# EAGLE design 7v_reference (EAGLE 8.4.1)
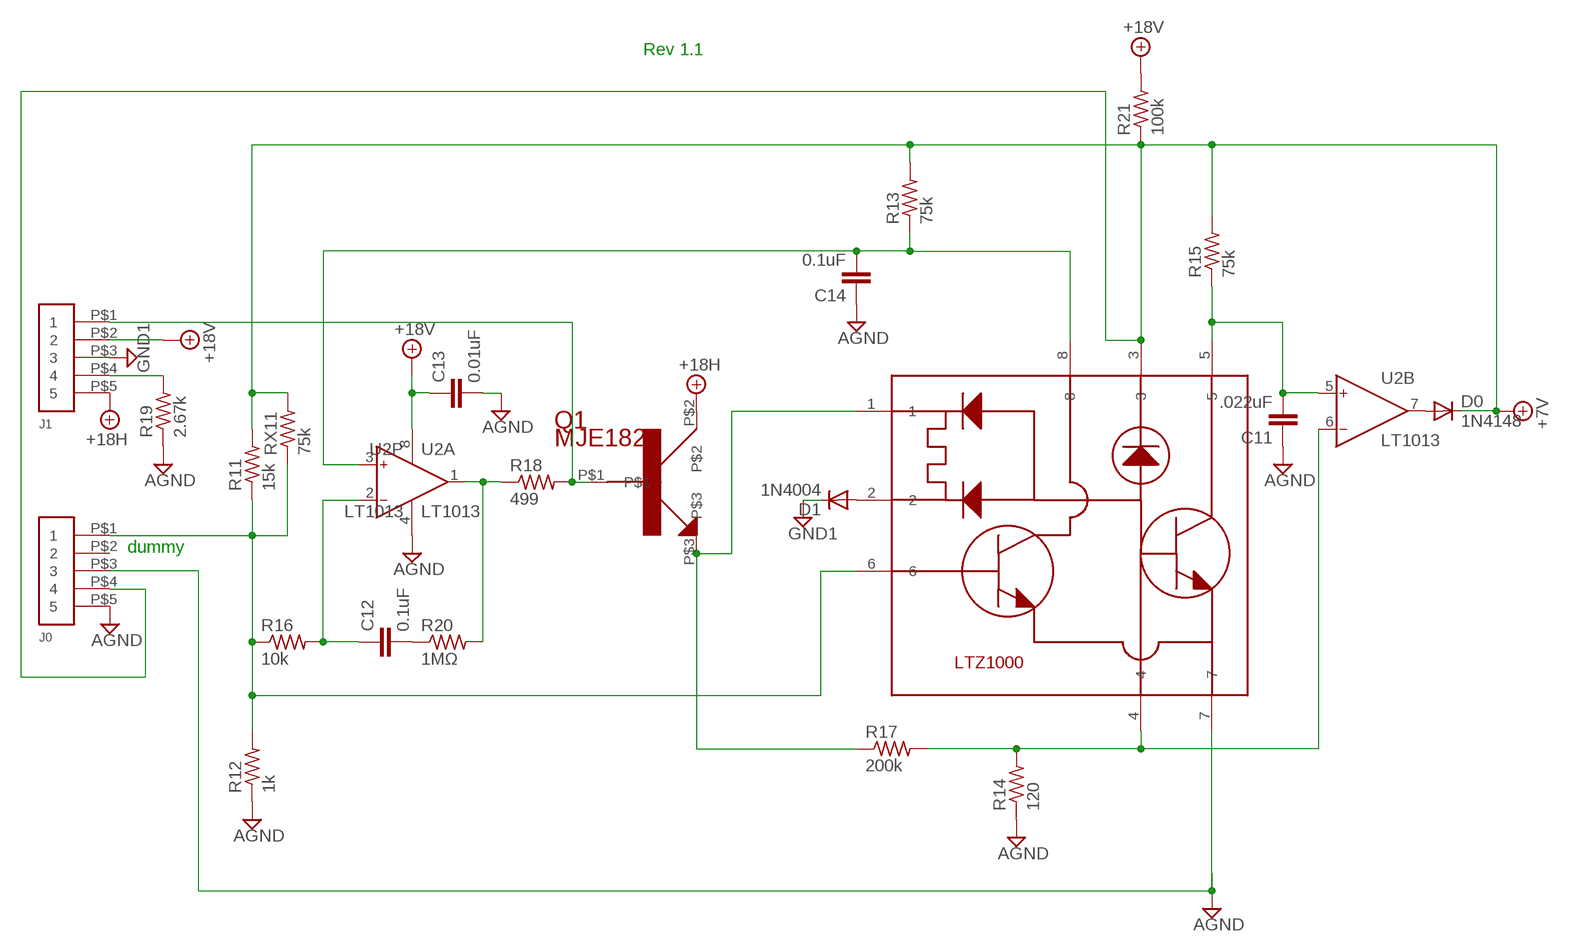
[diagram p0: schematic, sheet 1]

## Parts
C11  .022uF  C-EU102-043X133  [C102-043X133]
C12  0.1uF  C-EU102-043X133  [C102-043X133]
C13  0.01uF  C-EU102-043X133  [C102-043X133]
C14  0.1uF  C-EU102-043X133  [C102-043X133]
D0  1N4148  1N4446  [DO35-10]
D1  1N4004  [DO41-10]
J0  SOCKET1SOCKET1  [SOCKET1]
J1  SOCKET1SOCKET2  [SOCKET2]
Q1  MJE182  [SOT-32]
R11  15k  R-US_0411/3V  [0411V]
R12  1k  R-US_0411/3V  [0411V]
R13  75k  R-US_0207/10  [0207/10]
R14  120  R-US_0411/3V  [0411V]
R15  75k  R-US_0207/10  [0207/10]
R16  10k  R-US_0207/10  [0207/10]
R17  200k  R-US_0207/10  [0207/10]
R18  499  R-US_0207/10  [0207/10]
R19  2.67k  R-US_0207/10  [0207/10]
R20  1MΩ  R-US_0207/10  [0207/10]
R21  100k  R-US_0207/10  [0207/10]
RX11  75k  R-US_0207/10  [0207/10]
U2  LT1013  AD746N  [DIL08]
U$1  LTZ1000  [LTZ1000]

## Nets
+7V: D0.C J0.P$4 R11.2 R13.2 R15.2 R21.1 RX11.2 U$1.3
+18V: C13.1 J1.P$2 J1.P$5 Q1.P$2 R21.2 U2.8(P:V+) ; supply symbol labelled +18H
AGND: C11.1 C13.2 C14.1 J0.P$3 J0.P$5 R12.1 R14.1 R19.1 U2.4(P:V-) U$1.7
GND1: D1.C J1.P$3
N$1: C11.2 R15.1 U2.5(B:IN+) U$1.5
N$2: J1.P$1 Q1.P$1 R18.2
N$3: D1.A U$1.2
N$4: D0.A U2.7(B:OUT)
N$5: J0.P$1 R11.1 R12.2 R16.1 RX11.1 U$1.6
N$6: R14.2 R17.2 U2.6(B:IN-) U$1.4
N$7: C14.2 R13.1 U2.3(A:IN+) U$1.8
N$8: R18.1 R20.2 U2.1(A:OUT)
N$9: C12.1 R16.2 U2.2(A:IN-)
N$10: C12.2 R20.1
N$11: J1.P$4 R19.2
N$12: Q1.P$3 R17.1 U$1.1
Unconnected: J0.P$2

## Notes on the sheet
- Rev 1.1
- dummy

## Library data of the parts
C11-C14 = sb:C-EU: CAPACITOR, European symbol
D0 = sb:1N4446: DIODE high speed (Philips)
D1 = sb:1N4004: DIODE general purpose rectifier, 1 A
J0 J1 = sb:SOCKET1: Test Socket 1
Q1 = sb:MJE182
R11 R12 R14 = sb:R-US_: RESISTOR, American symbol
R13 R15-R21 RX11 = adafruit:R-US_: RESISTOR, American symbol
U2 = analog-devices:AD746: Dual Precision, 500 ns Settling, BiFET Op Amp Source: http://www.analog.com/static/imported-files/data_sheets/AD746.pdf; MF: ALTERA CORPORATION; MPN: AD746JNZ; OC_FARNELL: 1438363; OC_NEWARK: 59K4844
U$1 = sb:LTZ1000: LTZ1000 7V ref

## Board
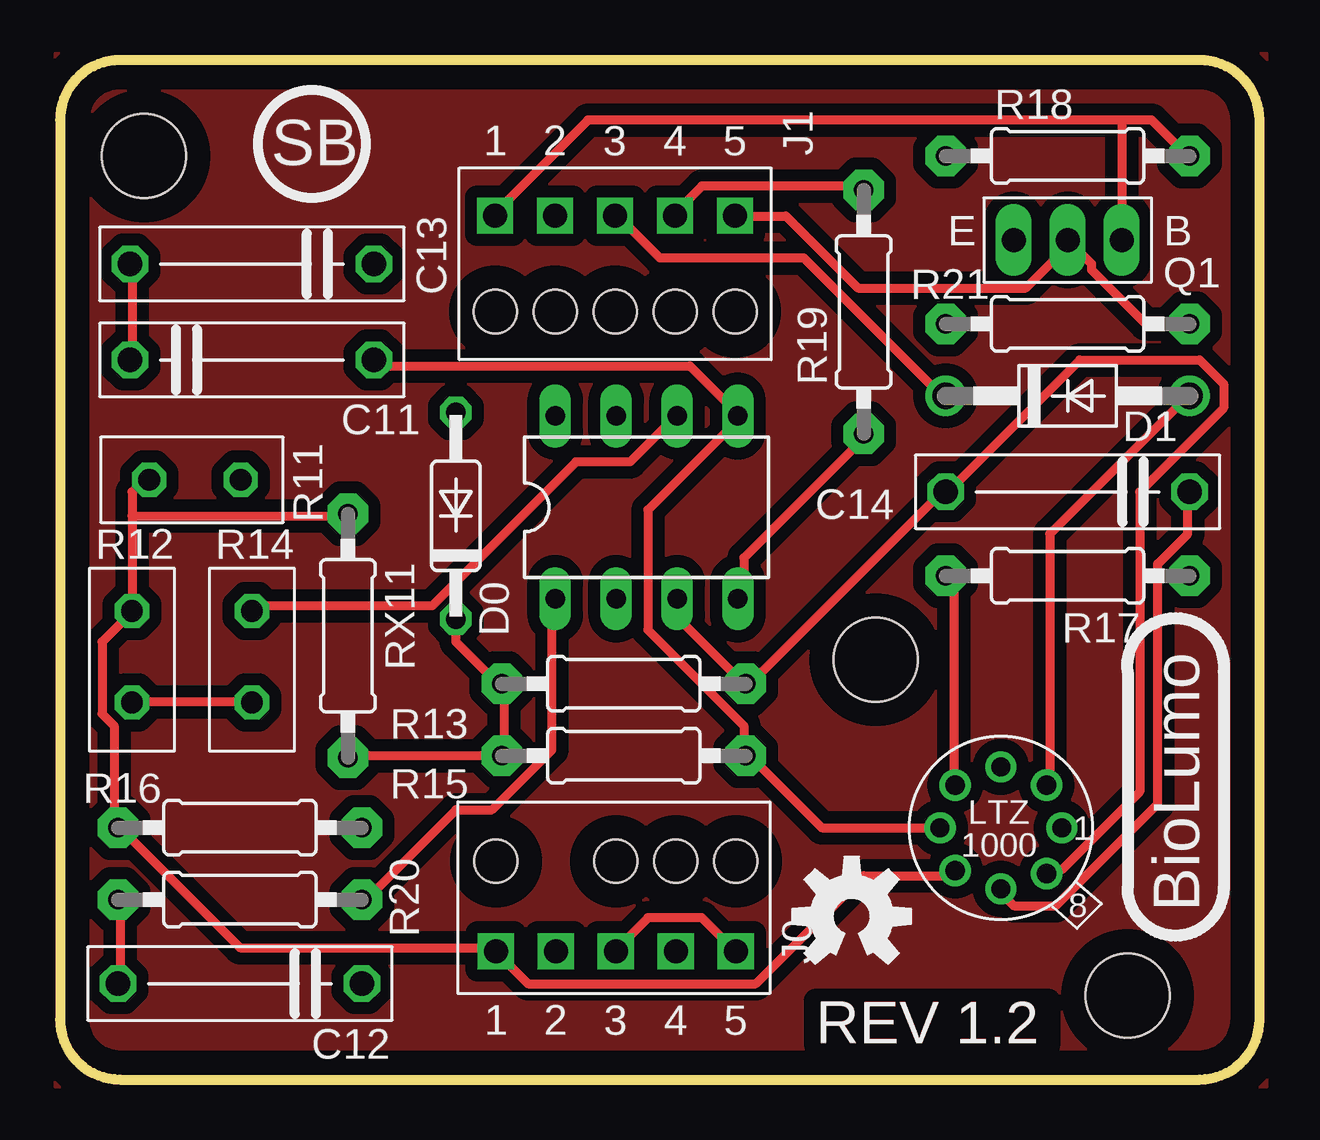
[diagram p1: board, top side]
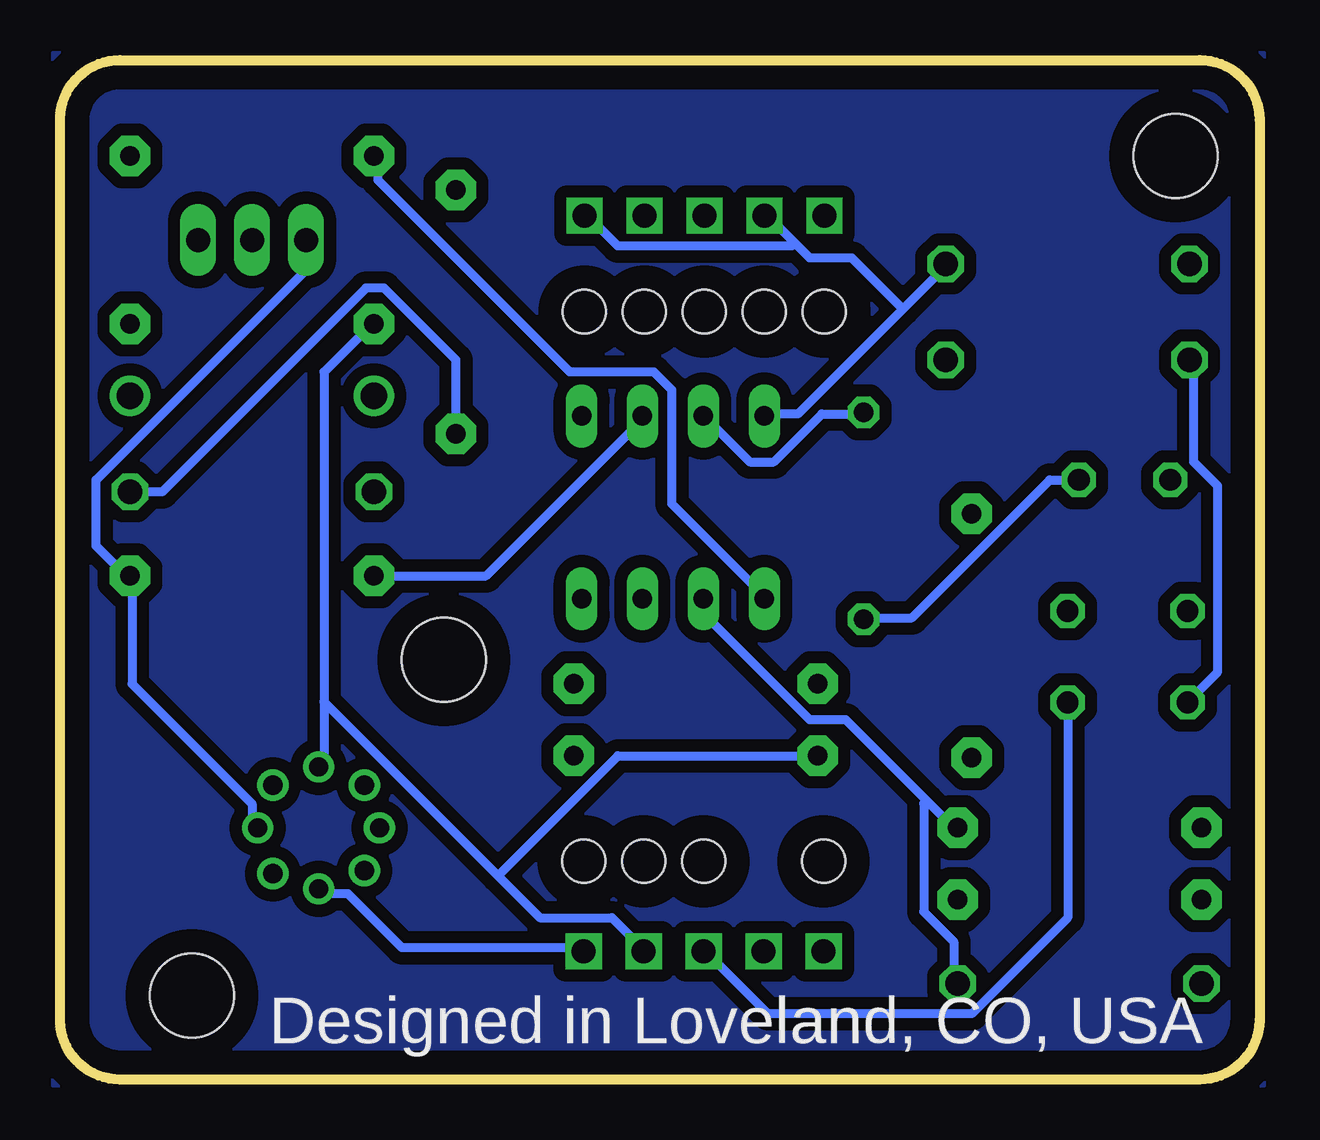
[diagram p2: board, bottom side, seen from below]

Size 50 x 42.5 mm. Coordinates in mm from the lower left corner, seen from the top.
Outline: 2.5,0 47.5,0 arc90 50,2.5 50,40 arc90 47.5,42.5 2.5,42.5 arc90 0,40 0,2.5 arc90 2.5,0
Copper layers (1*16): Top 0.035mm / dielectric 1.5mm / Bottom 0.035mm
Design rules "default *": minimum track width 15mil, minimum drill 24mil, track to track 20mil, track to pad 20mil, pad to pad 10mil, via to via 10mil, smd to smd 8mil, copper to edge 40mil, drill to drill 8mil, minimum pad ring 10mil, minimum via ring 8mil, stop-mask expansion 4mil, vias tented up to drill 0mil, thermal gap 10mil
Holes 3.5 mm at 3.5,38.5 44.5,3.5 34,17.5

### Footprints (pad centres in the part's own frame; a part is rotated, then mirrored left to right if it is on the bottom)
C102-043X133 = drill 1.016 octagon: 1 -5.08,0; 2 5.08,0
DO35-10 = drill 0.8 octagon: A 4.31,0; C -4.31,0
DO41-10 = drill 1.118: A 5.08,0; C -5.08,0
SOCKET1 = drill 1 square: P$1 -5,-2; P$2 -2.5,-2; P$3 0,-2; P$4 2.5,-2; P$5 5,-2 | hole 1.8: -5,1.75; 0,1.75; 2.5,1.75; 5,1.75
SOCKET2 = drill 1 square: P$1 -5,2; P$2 -2.5,2; P$3 0,2; P$4 2.5,2; P$5 5,2 | hole 1.8: -5,-2; -2.5,-2; 0,-2; 2.5,-2; 5,-2
SOT-32 = drill 1 long: P$1 2.25,0; P$2 0,0; P$3 -2.25,0
0411V = drill 0.914 octagon: 1 -1.778,0; 2 2.032,0
0207/10 = drill 0.813 pad 1.676 octagon: 1 -5.08,0; 2 5.08,0
DIL08 = drill 0.813 long: 1 -3.81,-3.81; 2 -1.27,-3.81; 3 1.27,-3.81; 4 3.81,-3.81; 5 3.81,3.81; 6 1.27,3.81; 7 -1.27,3.81; 8 -3.81,3.81
LTZ1000 = drill 0.8: 1 -2.54,0; 2 -1.905,-1.778; 3 0,-2.54; 4 1.905,-1.778; 5 2.54,0; 6 1.905,1.778; 7 0,2.54; 8 -1.905,1.905

### Placement (x,y rotation side)
C11  8,30 0 top
C12  7.5,4 180 top
C13  8,34 180 top
C14  42,24.5 180 top
D0  16.5,23.5 90 top
D1  42,28.5 0 top
J0  23.17,7.35 0 top
J1  23.14,34.01 0 top
Q1  42,35 0 top
R11  5.5,25 0 top
R12  3,17.5 90 top
R13  23.5,16.5 180 top
R14  8,17.5 90 top
R15  23.5,13.5 180 top
R16  7.5,10.5 0 top
R17  42,21 180 top
R18  42,38.5 0 top
R19  33.5,32 90 top
R20  7.5,7.5 0 top
R21  42,31.5 0 top
RX11  12,18.5 270 top
U2  24.45,23.85 0 top
U$1  39.22,10.49 180 top
U$2  [OSHW-LOGO-M]  33,6.8 0 top

### Tracks (layer width: path | path; a pad name or v marks a point on that pad's centre or on a via)
+7V
  Top 0.381: RX11.2 12,13.5 R15.2 18.5,13.5 18.5,16.5 R13.2 18.25,16.5 16.5,18.25 D0.C
  Bottom 0.381: R11.2 8.75,25 14.5,19.25 16.5,19.25 D0.C | 39,15.75 39,29.5 37,31.5 R21.1 | 39,15.75 39,13.25 U$1.3 | 39,15.75 31.75,8.5 | 31.75,8.5 30,6.75 27,6.75 25.75,5.5 J0.P$4 | R15.2 26.75,13.5 31.75,8.5
+18V
  Top 0.381: R21.2 45.25,31.5 43,33.75 43,34 Q1.P$2 42,34.75 40.25,33 33.25,33 30.25,36 28.25,36 J1.P$5
  Bottom 0.381: 14.88,32.12 13,34 C13.1 | 14.88,32.12 19.25,27.75 20.5,27.75 U2.8 | 19.38,34.88 18.75,34.25 17,34.25 14.88,32.12 | 19.38,34.88 20.5,36 J1.P$2 | J1.P$5 28,36 26.75,34.75 19.5,34.75 19.38,34.88
AGND
  Top 0.381: U2.4 28.5,20.25 28.5,21.75 33.5,26.75 R19.1 | J0.P$3 23.25,5.5 24.5,6.75 26.75,6.75 28,5.5 J0.P$5 | C11.1 3,30 3,34 C13.2 | R12.1 3,15.75 8,15.75 R14.1 | C14.1 47,24.5 47,22.75 45.75,21.5 45.75,11.5 41.5,7.25 39.75,7.25 39.25,7.75 U$1.7
  Bottom 0.381: C14.1 45.75,24.5 37.25,33 36.5,33 33.5,30 R19.1 | U$1.7 39,7.75 38,7.75 35.75,5.5 28.25,5.5 J0.P$5 | C11.1 2.75,30 2.75,25.75 1.75,24.75 1.75,17 3,15.75 R12.1 | R14.1 8,6.75 12,2.75 20.5,2.75 23,5.25 J0.P$3
GND
  pour Top: -0.2,-0.3 -0.2,42.76 50.3,42.76 50.3,-0.3
  pour Bottom: -0.2,-0.27 -0.2,42.8 50.3,42.8 50.3,-0.27
GND1
  Top 0.381: J1.P$3 23.25,36 25,34.25 31,34.25 36.75,28.5 D1.C
N$1
  Top 0.381: U$1.5 36.5,10.5 31.75,10.5 28.75,13.5 R15.1 28.5,13.5 28.5,14.75 24.5,18.75 24.5,23.75 28.25,27.5 U2.5 28.25,27.75 26.25,29.75 13.5,29.75 13.25,30 C11.2
N$2
  Top 0.381: 44.25,40 45.5,40 47,38.5 R18.2 | 44.25,40 22,40 18.25,36.25 J1.P$1 | 44.25,40 Q1.P$1
N$3
  Top 0.381: U$1.2 41.25,12.5 41.25,22.75 47,28.5 D1.A
N$4
  Bottom 0.381: D0.A 16.5,27.75 18.25,27.75 20.25,25.75 21.25,25.75 23,27.5 U2.7
N$5
  Top 0.381: U$1.6 37.25,8.5 33.5,8.5 29,4 19.5,4 18.25,5.25 J0.P$1 18,5.5 7.5,5.5 2.5,10.5 R16.1 2.25,10.5 2.25,14.75 1.75,15.25 1.75,18.25 3,19.5 R12.2 3,23.5 | 3,23.5 3,24.5 3.5,25 R11.1 | 3,23.5 12,23.5 RX11.1
N$6
  Top 0.381: U$1.4 37.25,12.5 37.25,20.75 37,21 R17.2 | R14.2 8,19.75 15.5,19.75 21.5,25.75 23.75,25.75 25.5,27.5 U2.6
  Bottom 0.381: R17.2 32.25,21 25.75,27.5 U2.6
N$7
  Top 0.381: U2.3 25.75,20 25.75,19.25 28.5,16.5 R13.1 28.75,16.5 36.75,24.5 C14.2 37,24.5 42.5,30 47.5,30 48.5,29 48.5,28 45,24.5 45,12 41.75,8.75 41.25,8.75 U$1.8
N$8
  Top 0.381: U2.1 20.5,20 20.5,13.75 18,11.25 16.5,11.25 12.75,7.5 R20.2
  Bottom 0.381: R18.1 36.75,38.5 36.75,37.5 28.75,29.5 25.25,29.5 24.5,28.75 24.5,24 20.75,20.25 U2.1
N$9
  Bottom 0.381: 13.88,11.62 12.75,10.5 R16.2 | 13.88,11.62 17.25,15 18.75,15 23,19.25 23,20 U2.2 | C12.1 12.75,4 12.75,5.75 14,7 14,11.5 13.88,11.62
N$10
  Top 0.381: C12.2 2.5,4 2.5,7.5 R20.1
N$11
  Top 0.381: J1.P$4 25.75,36.25 26.75,37.25 33.5,37.25 R19.2
N$12
  Bottom 0.381: U$1.1 42,10.5 42,11.5 47,16.5 47,21 R17.1 47.25,21 48.5,22.25 48.5,25 39.75,33.75 Q1.P$3

### Text on the board
Top: REV 1.2
tPlace: SB | BioLumo | REV 1.2
bPlace: Designed in Loveland, CO, USA